# EAGLE schematic r (EAGLE 9.6.2)
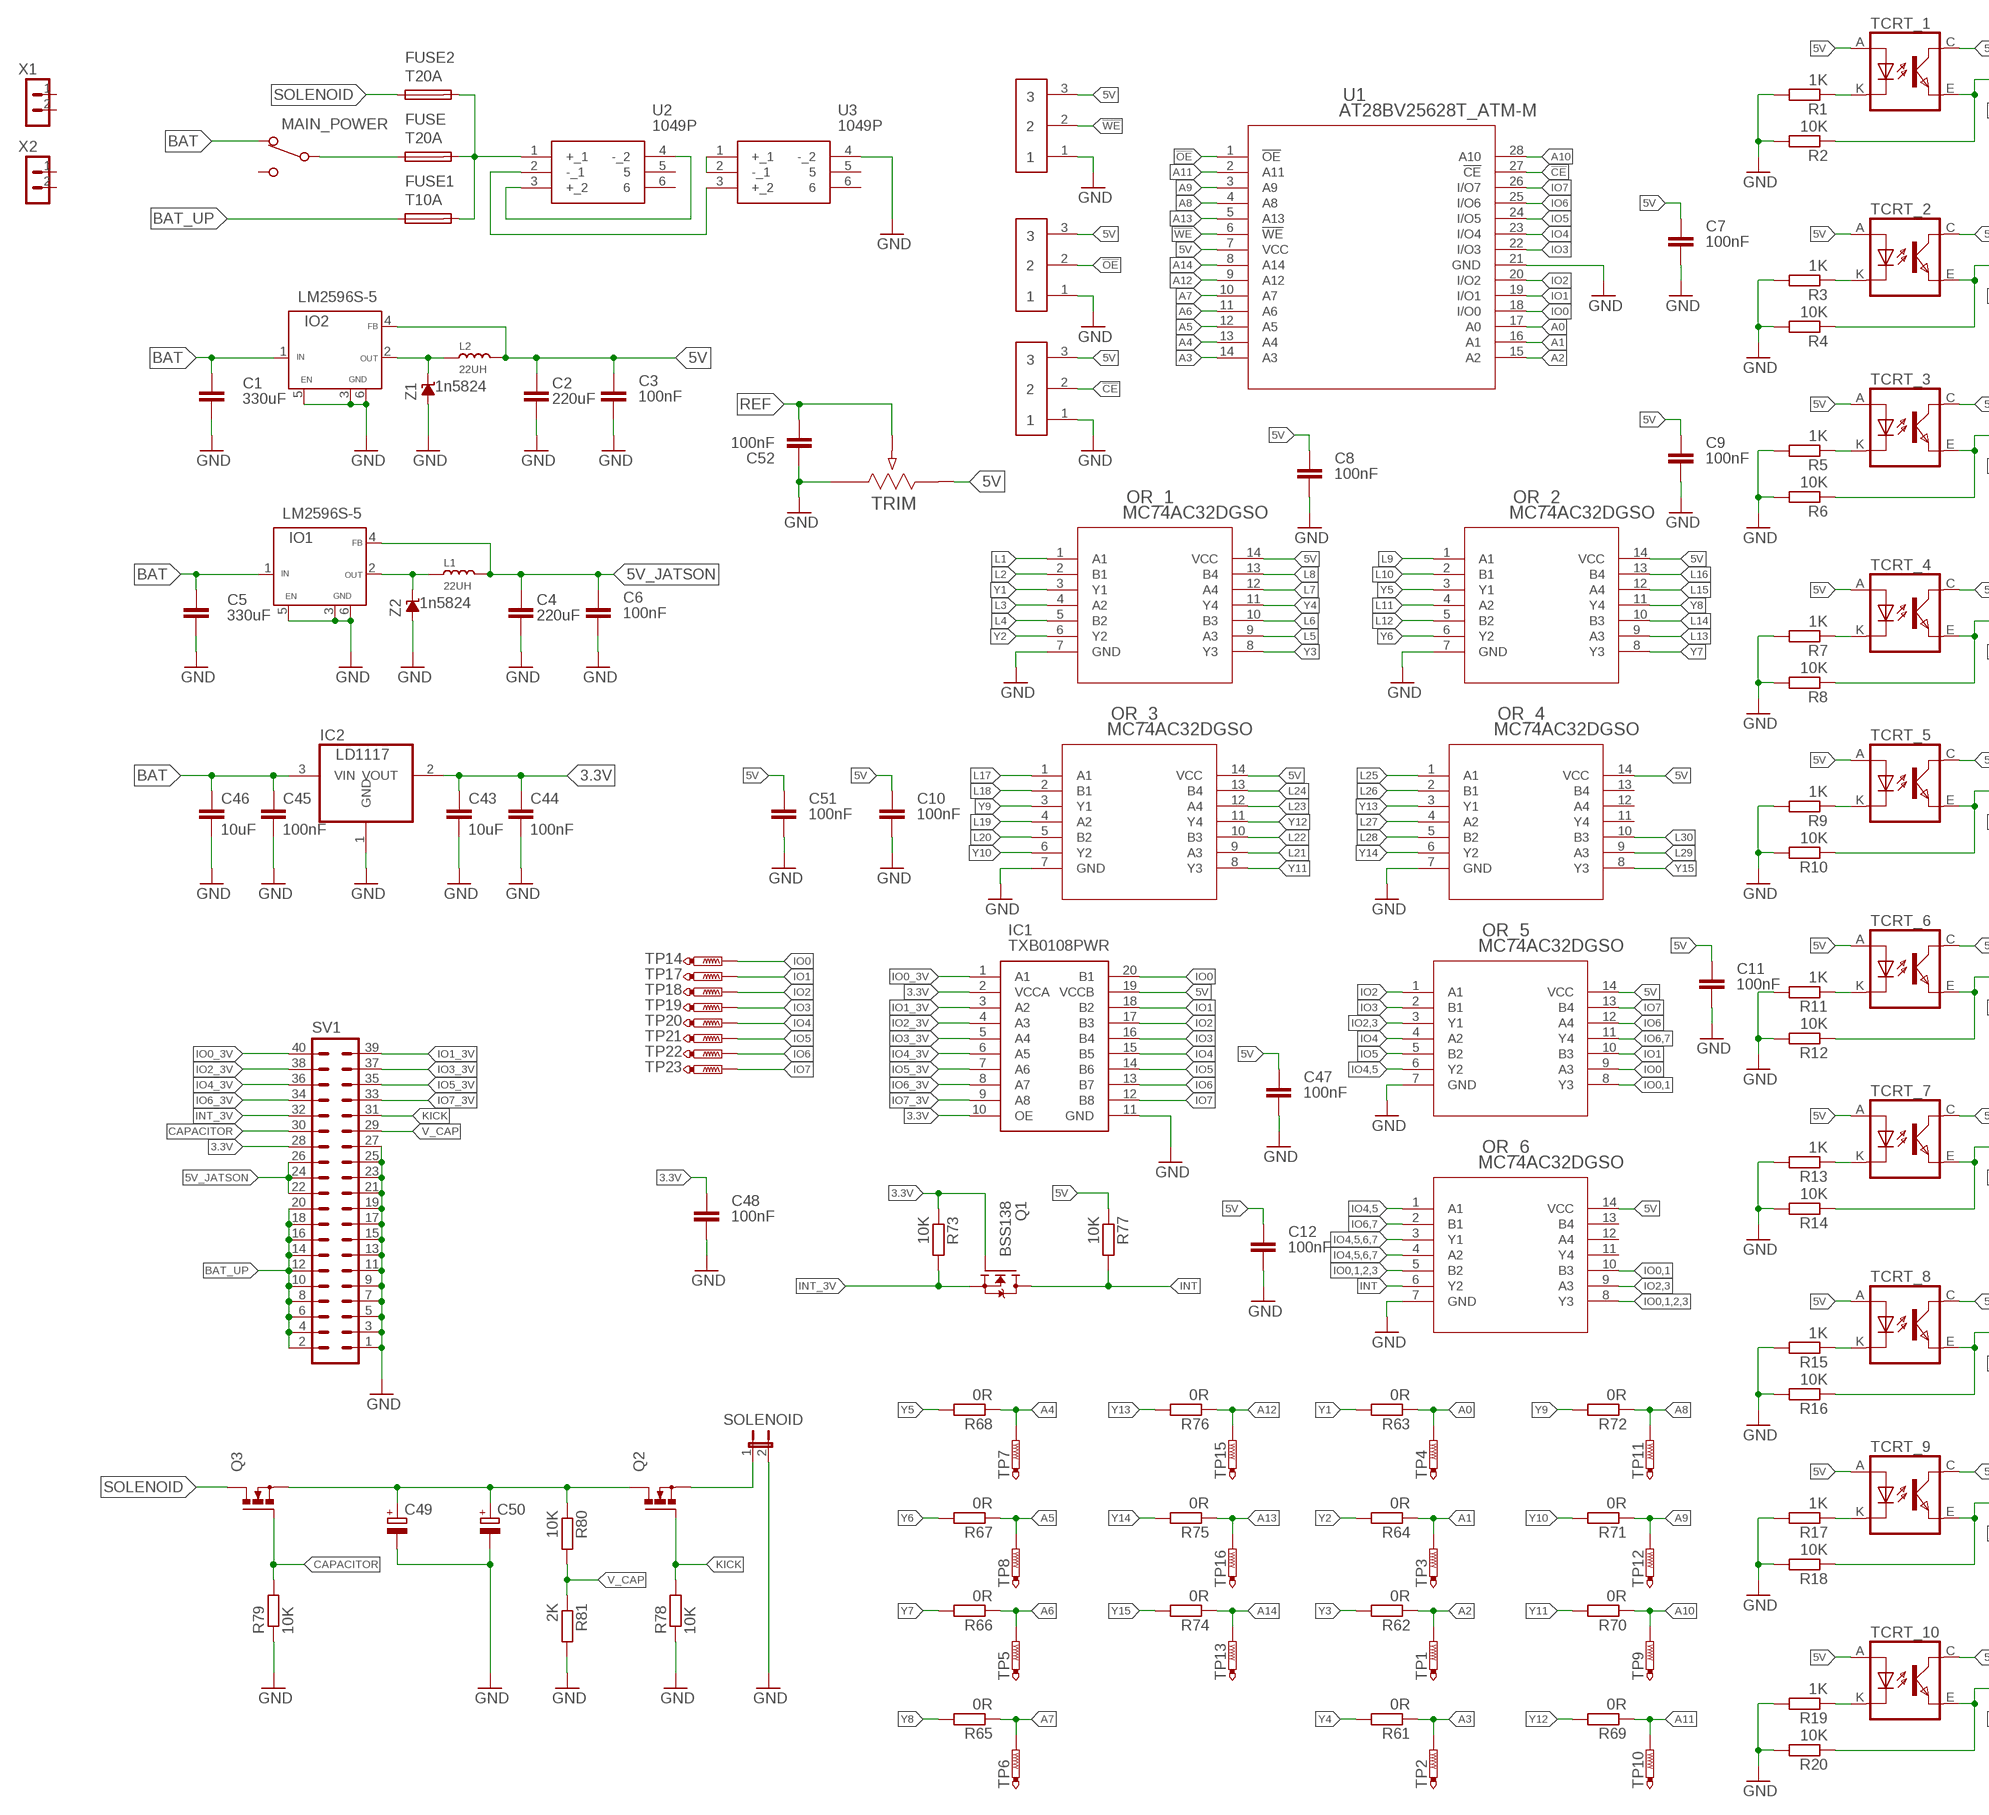
[diagram p0: schematic, sheet 1, part 1 of 2]
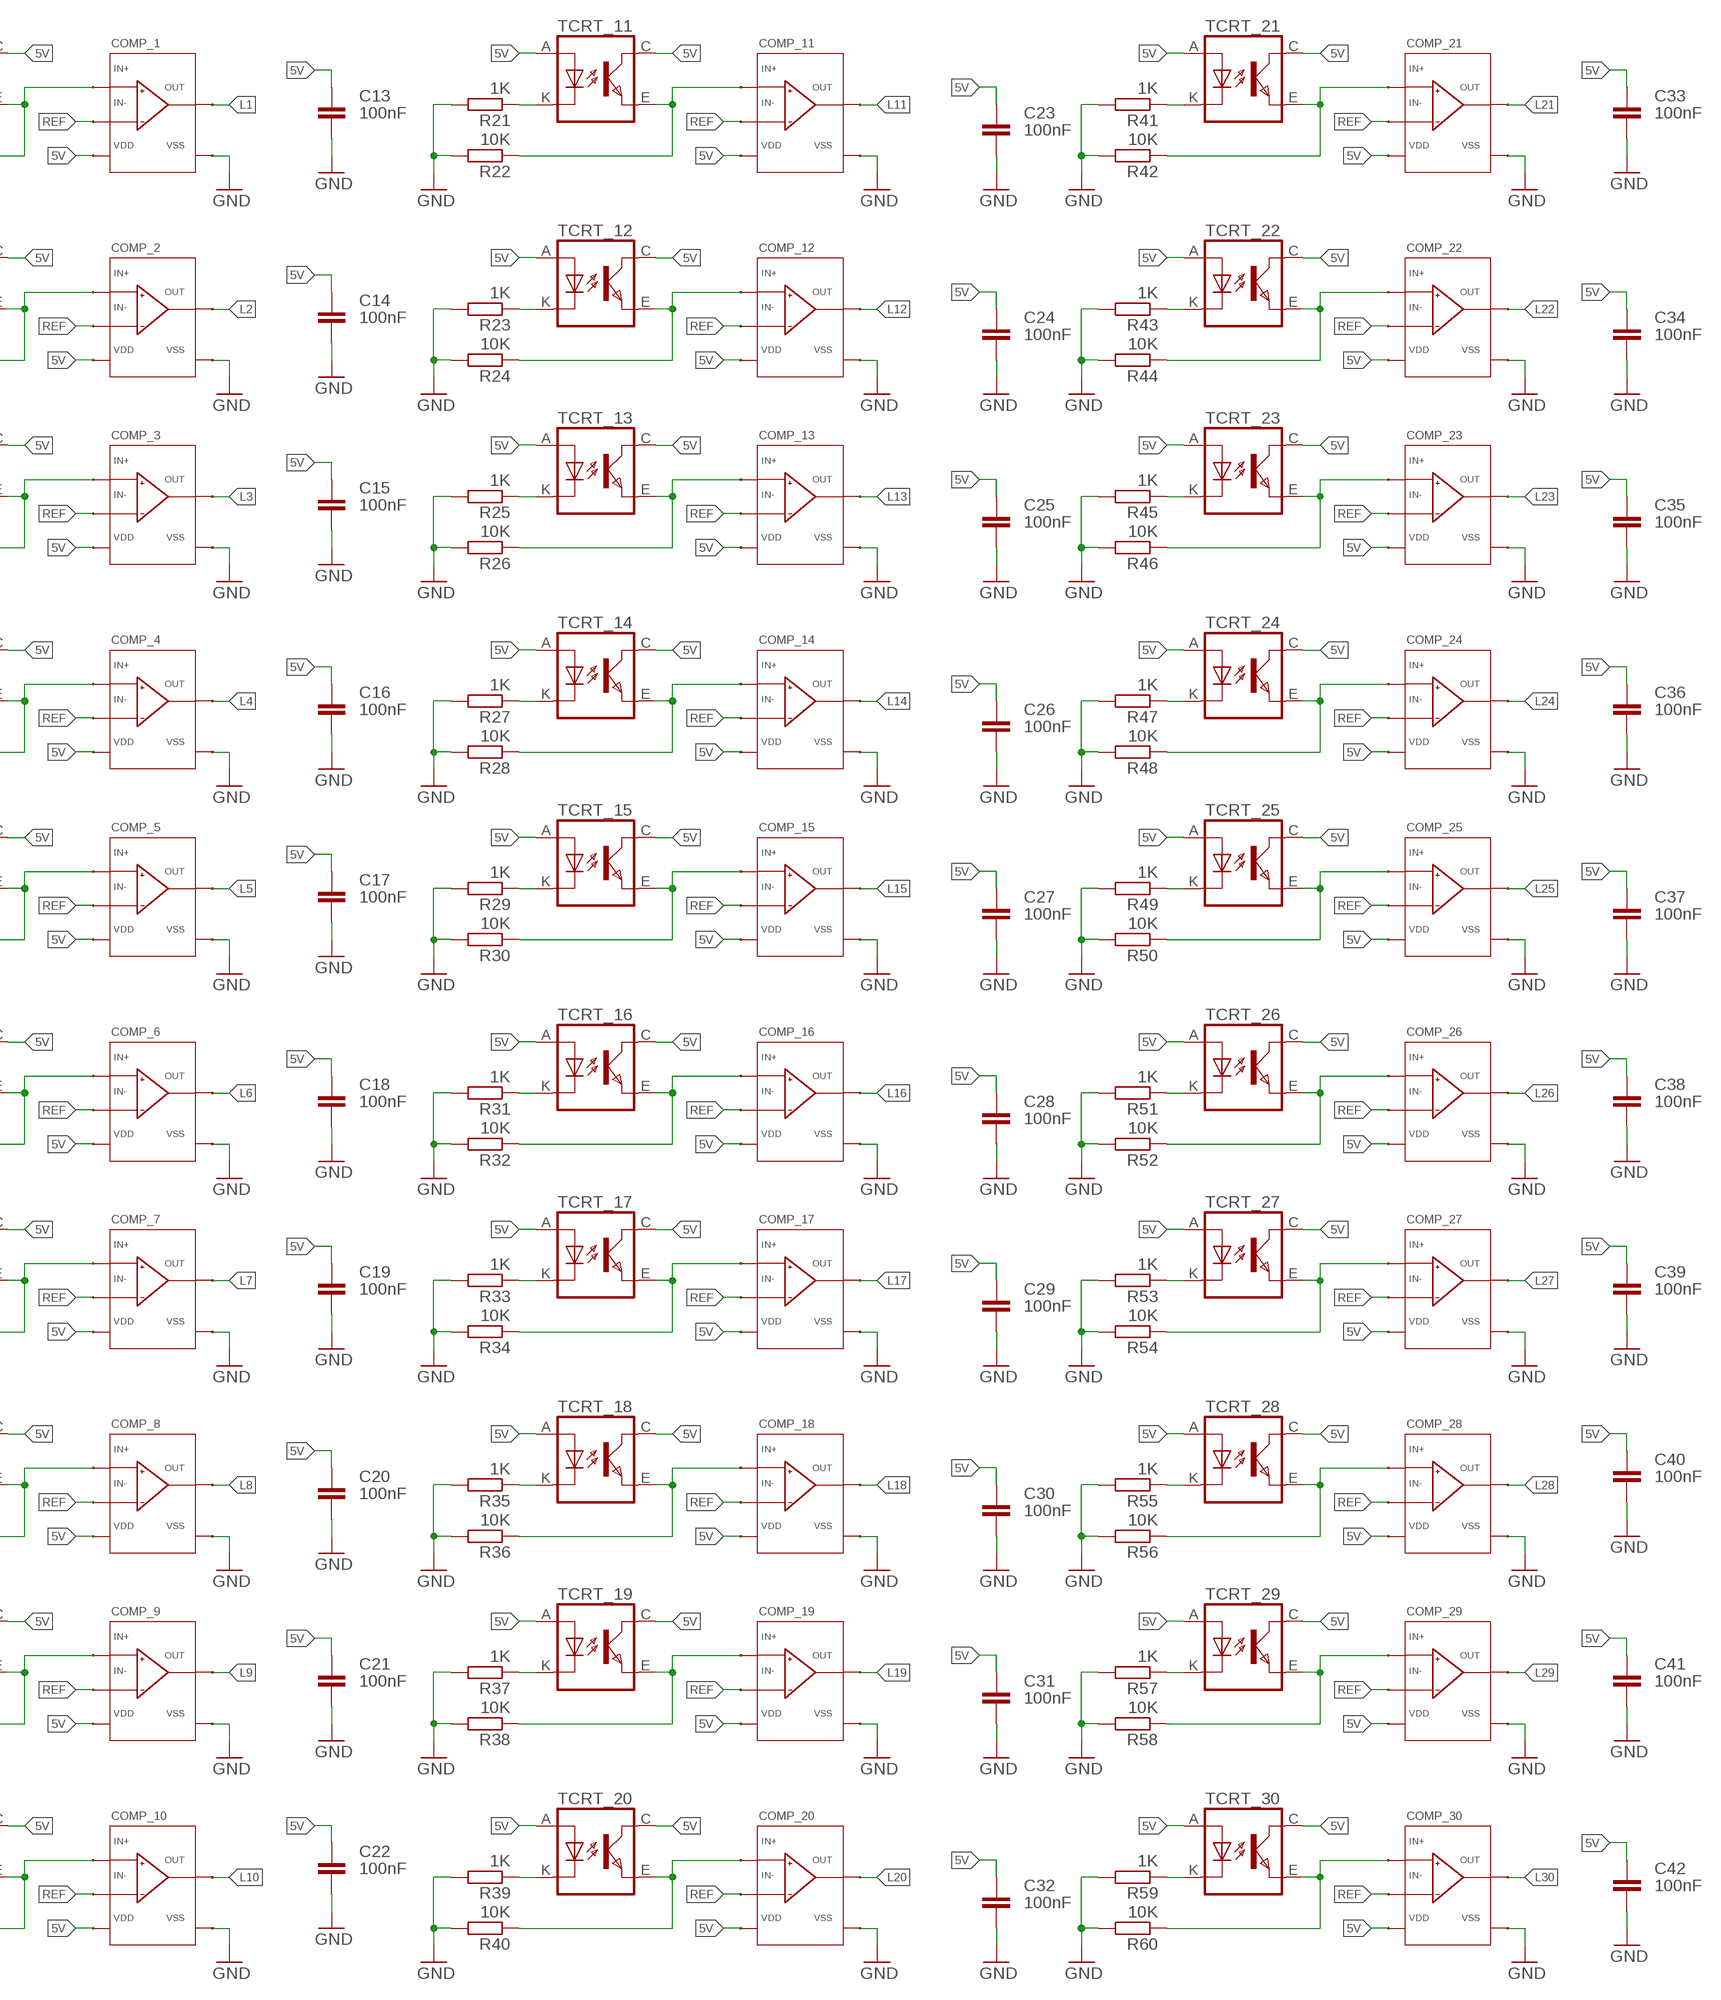
[diagram p1: schematic, sheet 1, part 2 of 2]

## Parts
C1  330uF  C_TANTALUM-2917(7343-METRIC)  [CAPM7343X310]
C2  220uF  C_TANTALUM-2917(7343-METRIC)  [CAPM7343X310]
C3  100nF  C-EUC0603  [C0603]
C4  220uF  C_TANTALUM-2917(7343-METRIC)  [CAPM7343X310]
C5  330uF  C_TANTALUM-2917(7343-METRIC)  [CAPM7343X310]
C6  100nF  C-EUC0603  [C0603]
C7  100nF  C-EUC0603  [C0603]
C8  100nF  C-EUC0603  [C0603]
C9  100nF  C-EUC0603  [C0603]
C10  100nF  C-EUC0603  [C0603]
C11  100nF  C-EUC0603  [C0603]
C12  100nF  C-EUC0603  [C0603]
C13  100nF  C-EUC0603  [C0603]
C14  100nF  C-EUC0603  [C0603]
C15  100nF  C-EUC0603  [C0603]
C16  100nF  C-EUC0603  [C0603]
C17  100nF  C-EUC0603  [C0603]
C18  100nF  C-EUC0603  [C0603]
C19  100nF  C-EUC0603  [C0603]
C20  100nF  C-EUC0603  [C0603]
C21  100nF  C-EUC0603  [C0603]
C22  100nF  C-EUC0603  [C0603]
C23  100nF  C-EUC0603  [C0603]
C24  100nF  C-EUC0603  [C0603]
C25  100nF  C-EUC0603  [C0603]
C26  100nF  C-EUC0603  [C0603]
C27  100nF  C-EUC0603  [C0603]
C28  100nF  C-EUC0603  [C0603]
C29  100nF  C-EUC0603  [C0603]
C30  100nF  C-EUC0603  [C0603]
C31  100nF  C-EUC0603  [C0603]
C32  100nF  C-EUC0603  [C0603]
C33  100nF  C-EUC0603  [C0603]
C34  100nF  C-EUC0603  [C0603]
C35  100nF  C-EUC0603  [C0603]
C36  100nF  C-EUC0603  [C0603]
C37  100nF  C-EUC0603  [C0603]
C38  100nF  C-EUC0603  [C0603]
C39  100nF  C-EUC0603  [C0603]
C40  100nF  C-EUC0603  [C0603]
C41  100nF  C-EUC0603  [C0603]
C42  100nF  C-EUC0603  [C0603]
C43  10uF  C-EUC0603  [C0603]
C44  100nF  C-EUC0603  [C0603]
C45  100nF  C-EUC0603  [C0603]
C46  10uF  C-EUC0603  [C0603]
C47  100nF  C-EUC0603  [C0603]
C48  100nF  C-EUC0603  [C0603]
C49  CPOL-EUE10-30  [EB30D]
C50  CPOL-EUE10-30  [EB30D]
C51  100nF  C-EUC0603  [C0603]
C52  100nF  C-EUC0603  [C0603]
COMP_1  TC75S56FUTE85LF  [SOT-353___(USV)_TOS]
COMP_2  TC75S56FUTE85LF  [SOT-353___(USV)_TOS]
COMP_3  TC75S56FUTE85LF  [SOT-353___(USV)_TOS]
COMP_4  TC75S56FUTE85LF  [SOT-353___(USV)_TOS]
COMP_5  TC75S56FUTE85LF  [SOT-353___(USV)_TOS]
COMP_6  TC75S56FUTE85LF  [SOT-353___(USV)_TOS]
COMP_7  TC75S56FUTE85LF  [SOT-353___(USV)_TOS]
COMP_8  TC75S56FUTE85LF  [SOT-353___(USV)_TOS]
COMP_9  TC75S56FUTE85LF  [SOT-353___(USV)_TOS]
COMP_10  TC75S56FUTE85LF  [SOT-353___(USV)_TOS]
COMP_11  TC75S56FUTE85LF  [SOT-353___(USV)_TOS]
COMP_12  TC75S56FUTE85LF  [SOT-353___(USV)_TOS]
COMP_13  TC75S56FUTE85LF  [SOT-353___(USV)_TOS]
COMP_14  TC75S56FUTE85LF  [SOT-353___(USV)_TOS]
COMP_15  TC75S56FUTE85LF  [SOT-353___(USV)_TOS]
COMP_16  TC75S56FUTE85LF  [SOT-353___(USV)_TOS]
COMP_17  TC75S56FUTE85LF  [SOT-353___(USV)_TOS]
COMP_18  TC75S56FUTE85LF  [SOT-353___(USV)_TOS]
COMP_19  TC75S56FUTE85LF  [SOT-353___(USV)_TOS]
COMP_20  TC75S56FUTE85LF  [SOT-353___(USV)_TOS]
COMP_21  TC75S56FUTE85LF  [SOT-353___(USV)_TOS]
COMP_22  TC75S56FUTE85LF  [SOT-353___(USV)_TOS]
COMP_23  TC75S56FUTE85LF  [SOT-353___(USV)_TOS]
COMP_24  TC75S56FUTE85LF  [SOT-353___(USV)_TOS]
COMP_25  TC75S56FUTE85LF  [SOT-353___(USV)_TOS]
COMP_26  TC75S56FUTE85LF  [SOT-353___(USV)_TOS]
COMP_27  TC75S56FUTE85LF  [SOT-353___(USV)_TOS]
COMP_28  TC75S56FUTE85LF  [SOT-353___(USV)_TOS]
COMP_29  TC75S56FUTE85LF  [SOT-353___(USV)_TOS]
COMP_30  TC75S56FUTE85LF  [SOT-353___(USV)_TOS]
FUSE  T20A  POISTKA2A  [SH22,5A]
FUSE1  T10A  POISTKA2A  [SH22,5A]
FUSE2  T20A  POISTKA2A  [SH22,5A]
IC1  TXB0108PWR  [SOP65P640X120-20N]
IC2  LD1117  [SOT223]
IO1  LM2596S-5  LM2596S  [TO263-5]
IO2  LM2596S-5  LM2596S  [TO263-5]
L1  22UH  INDUCTOR/FERRITE-BEAD0630  [INDUCTOR_L0630]
L2  22UH  INDUCTOR/FERRITE-BEAD0630  [INDUCTOR_L0630]
MAIN_POWER  PREP-1PB  [P-B069B]
OR_1  MC74AC32DGSO  MC74AC32DGSOIC-14_NB_ONS-M  [SOIC-14_NB_ONS-M]
OR_2  MC74AC32DGSO  MC74AC32DGSOIC-14_NB_ONS-M  [SOIC-14_NB_ONS-M]
OR_3  MC74AC32DGSO  MC74AC32DGSOIC-14_NB_ONS-M  [SOIC-14_NB_ONS-M]
OR_4  MC74AC32DGSO  MC74AC32DGSOIC-14_NB_ONS-M  [SOIC-14_NB_ONS-M]
OR_5  MC74AC32DGSO  MC74AC32DGSOIC-14_NB_ONS-M  [SOIC-14_NB_ONS-M]
OR_6  MC74AC32DGSO  MC74AC32DGSOIC-14_NB_ONS-M  [SOIC-14_NB_ONS-M]
Q1  BSS138  [SOT23]
Q2  PMOSFET_NTO220BV  [TO220BV]
Q3  PMOSFET_NTO220BV  [TO220BV]
R1  1K  R-EU_R0603  [R0603]
R2  10K  R-EU_R0603  [R0603]
R3  1K  R-EU_R0603  [R0603]
R4  10K  R-EU_R0603  [R0603]
R5  1K  R-EU_R0603  [R0603]
R6  10K  R-EU_R0603  [R0603]
R7  1K  R-EU_R0603  [R0603]
R8  10K  R-EU_R0603  [R0603]
R9  1K  R-EU_R0603  [R0603]
R10  10K  R-EU_R0603  [R0603]
R11  1K  R-EU_R0603  [R0603]
R12  10K  R-EU_R0603  [R0603]
R13  1K  R-EU_R0603  [R0603]
R14  10K  R-EU_R0603  [R0603]
R15  1K  R-EU_R0603  [R0603]
R16  10K  R-EU_R0603  [R0603]
R17  1K  R-EU_R0603  [R0603]
R18  10K  R-EU_R0603  [R0603]
R19  1K  R-EU_R0603  [R0603]
R20  10K  R-EU_R0603  [R0603]
R21  1K  R-EU_R0603  [R0603]
R22  10K  R-EU_R0603  [R0603]
R23  1K  R-EU_R0603  [R0603]
R24  10K  R-EU_R0603  [R0603]
R25  1K  R-EU_R0603  [R0603]
R26  10K  R-EU_R0603  [R0603]
R27  1K  R-EU_R0603  [R0603]
R28  10K  R-EU_R0603  [R0603]
R29  1K  R-EU_R0603  [R0603]
R30  10K  R-EU_R0603  [R0603]
R31  1K  R-EU_R0603  [R0603]
R32  10K  R-EU_R0603  [R0603]
R33  1K  R-EU_R0603  [R0603]
R34  10K  R-EU_R0603  [R0603]
R35  1K  R-EU_R0603  [R0603]
R36  10K  R-EU_R0603  [R0603]
R37  1K  R-EU_R0603  [R0603]
R38  10K  R-EU_R0603  [R0603]
R39  1K  R-EU_R0603  [R0603]
R40  10K  R-EU_R0603  [R0603]
R41  1K  R-EU_R0603  [R0603]
R42  10K  R-EU_R0603  [R0603]
R43  1K  R-EU_R0603  [R0603]
R44  10K  R-EU_R0603  [R0603]
R45  1K  R-EU_R0603  [R0603]
R46  10K  R-EU_R0603  [R0603]
R47  1K  R-EU_R0603  [R0603]
R48  10K  R-EU_R0603  [R0603]
R49  1K  R-EU_R0603  [R0603]
R50  10K  R-EU_R0603  [R0603]
R51  1K  R-EU_R0603  [R0603]
R52  10K  R-EU_R0603  [R0603]
R53  1K  R-EU_R0603  [R0603]
R54  10K  R-EU_R0603  [R0603]
R55  1K  R-EU_R0603  [R0603]
R56  10K  R-EU_R0603  [R0603]
R57  1K  R-EU_R0603  [R0603]
R58  10K  R-EU_R0603  [R0603]
R59  1K  R-EU_R0603  [R0603]
R60  10K  R-EU_R0603  [R0603]
R61  0R  R-EU_R0603  [R0603]
R62  0R  R-EU_R0603  [R0603]
R63  0R  R-EU_R0603  [R0603]
R64  0R  R-EU_R0603  [R0603]
R65  0R  R-EU_R0603  [R0603]
R66  0R  R-EU_R0603  [R0603]
R67  0R  R-EU_R0603  [R0603]
R68  0R  R-EU_R0603  [R0603]
R69  0R  R-EU_R0603  [R0603]
R70  0R  R-EU_R0603  [R0603]
R71  0R  R-EU_R0603  [R0603]
R72  0R  R-EU_R0603  [R0603]
R73  10K  R-EU_R0603  [R0603]
R74  0R  R-EU_R0603  [R0603]
R75  0R  R-EU_R0603  [R0603]
R76  0R  R-EU_R0603  [R0603]
R77  10K  R-EU_R0603  [R0603]
R78  10K  R-EU_R1206  [R1206]
R79  10K  R-EU_R1206  [R1206]
R80  10K  R-EU_R0603  [R0603]
R81  2K  R-EU_R0603  [R0603]
SOLENOID  JP1E  [JP1]
SV1  MLW40  [ML40]
TCRT_1  TCRT5000  [TCRT5000]
TCRT_2  TCRT5000  [TCRT5000]
TCRT_3  TCRT5000  [TCRT5000]
TCRT_4  TCRT5000  [TCRT5000]
TCRT_5  TCRT5000  [TCRT5000]
TCRT_6  TCRT5000  [TCRT5000]
TCRT_7  TCRT5000  [TCRT5000]
TCRT_8  TCRT5000  [TCRT5000]
TCRT_9  TCRT5000  [TCRT5000]
TCRT_10  TCRT5000  [TCRT5000]
TCRT_11  TCRT5000  [TCRT5000]
TCRT_12  TCRT5000  [TCRT5000]
TCRT_13  TCRT5000  [TCRT5000]
TCRT_14  TCRT5000  [TCRT5000]
TCRT_15  TCRT5000  [TCRT5000]
TCRT_16  TCRT5000  [TCRT5000]
TCRT_17  TCRT5000  [TCRT5000]
TCRT_18  TCRT5000  [TCRT5000]
TCRT_19  TCRT5000  [TCRT5000]
TCRT_20  TCRT5000  [TCRT5000]
TCRT_21  TCRT5000  [TCRT5000]
TCRT_22  TCRT5000  [TCRT5000]
TCRT_23  TCRT5000  [TCRT5000]
TCRT_24  TCRT5000  [TCRT5000]
TCRT_25  TCRT5000  [TCRT5000]
TCRT_26  TCRT5000  [TCRT5000]
TCRT_27  TCRT5000  [TCRT5000]
TCRT_28  TCRT5000  [TCRT5000]
TCRT_29  TCRT5000  [TCRT5000]
TCRT_30  TCRT5000  [TCRT5000]
TP1  PTR1TP20R  [TP20R]
TP2  PTR1TP20R  [TP20R]
TP3  PTR1TP20R  [TP20R]
TP4  PTR1TP20R  [TP20R]
TP5  PTR1TP20R  [TP20R]
TP6  PTR1TP20R  [TP20R]
TP7  PTR1TP20R  [TP20R]
TP8  PTR1TP20R  [TP20R]
TP9  PTR1TP20R  [TP20R]
TP10  PTR1TP20R  [TP20R]
TP11  PTR1TP20R  [TP20R]
TP12  PTR1TP20R  [TP20R]
TP13  PTR1TP20R  [TP20R]
TP14  PTR1TP20R  [TP20R]
TP15  PTR1TP20R  [TP20R]
TP16  PTR1TP20R  [TP20R]
TP17  PTR1TP20R  [TP20R]
TP18  PTR1TP20R  [TP20R]
TP19  PTR1TP20R  [TP20R]
TP20  PTR1TP20R  [TP20R]
TP21  PTR1TP20R  [TP20R]
TP22  PTR1TP20R  [TP20R]
TP23  PTR1TP20R  [TP20R]
TRIM  3362W-1-103LF  [POT_3362W]
U1  AT28BV25628T_ATM-M  [28T_ATM-M]
U2  1049P  [1049P]
U3  1049P  [1049P]
U$1  0603_S  [0603_S]
U$2  0603_S  [0603_S]
U$3  0603_S  [0603_S]
X1  ML2"  [ML2]
X2  ML2"  [ML2]
Z1  1n5824  SUPRESSOR_TVS-UD-SMAJ  [SUPRESSOR_SMAJ]
Z2  1n5824  SUPRESSOR_TVS-UD-SMAJ  [SUPRESSOR_SMAJ]

## Nets
3.3V: C43.1 C44.1 C48.1 IC1.2(VCCA) IC1.10(OE) IC2.2(VOUT) Q1.1(G) R73.1 SV1.28
5V: C2.1 C3.1 C7.1 C8.1 C9.1 C10.1 C11.1 C12.1 C13.1 C14.1 C15.1 C16.1 C17.1 C18.1 C19.1 C20.1 C21.1 C22.1 C23.1 C24.1 C25.1 C26.1 C27.1 C28.1 C29.1 C30.1 C31.1 C32.1 C33.1 C34.1 C35.1 C36.1 C37.1 C38.1 C39.1 C40.1 C41.1 C42.1 C47.1 C51.1 COMP_1.5 COMP_2.5 COMP_3.5 COMP_4.5 COMP_5.5 COMP_6.5 COMP_7.5 COMP_8.5 COMP_9.5 COMP_10.5 COMP_11.5 COMP_12.5 COMP_13.5 COMP_14.5 COMP_15.5 COMP_16.5 COMP_17.5 COMP_18.5 COMP_19.5 COMP_20.5 COMP_21.5 COMP_22.5 COMP_23.5 COMP_24.5 COMP_25.5 COMP_26.5 COMP_27.5 COMP_28.5 COMP_29.5 COMP_30.5 IC1.19(VCCB) IO2.4(FB) L2.2 OR_1.14(VCC) OR_2.14(VCC) OR_3.14(VCC) OR_4.14(VCC) OR_5.14(VCC) OR_6.14(VCC) R77.1 TCRT_1.A(ANODE) TCRT_1.C(COLLECTOR) TCRT_2.A(ANODE) TCRT_2.C(COLLECTOR) TCRT_3.A(ANODE) TCRT_3.C(COLLECTOR) TCRT_4.A(ANODE) TCRT_4.C(COLLECTOR) TCRT_5.A(ANODE) TCRT_5.C(COLLECTOR) TCRT_6.A(ANODE) TCRT_6.C(COLLECTOR) TCRT_7.A(ANODE) TCRT_7.C(COLLECTOR) TCRT_8.A(ANODE) TCRT_8.C(COLLECTOR) TCRT_9.A(ANODE) TCRT_9.C(COLLECTOR) TCRT_10.A(ANODE) TCRT_10.C(COLLECTOR) TCRT_11.A(ANODE) TCRT_11.C(COLLECTOR) TCRT_12.A(ANODE) TCRT_12.C(COLLECTOR) TCRT_13.A(ANODE) TCRT_13.C(COLLECTOR) TCRT_14.A(ANODE) TCRT_14.C(COLLECTOR) TCRT_15.A(ANODE) TCRT_15.C(COLLECTOR) TCRT_16.A(ANODE) TCRT_16.C(COLLECTOR) TCRT_17.A(ANODE) TCRT_17.C(COLLECTOR) TCRT_18.A(ANODE) TCRT_18.C(COLLECTOR) TCRT_19.A(ANODE) TCRT_19.C(COLLECTOR) TCRT_20.A(ANODE) TCRT_20.C(COLLECTOR) TCRT_21.A(ANODE) TCRT_21.C(COLLECTOR) TCRT_22.A(ANODE) TCRT_22.C(COLLECTOR) TCRT_23.A(ANODE) TCRT_23.C(COLLECTOR) TCRT_24.A(ANODE) TCRT_24.C(COLLECTOR) TCRT_25.A(ANODE) TCRT_25.C(COLLECTOR) TCRT_26.A(ANODE) TCRT_26.C(COLLECTOR) TCRT_27.A(ANODE) TCRT_27.C(COLLECTOR) TCRT_28.A(ANODE) TCRT_28.C(COLLECTOR) TCRT_29.A(ANODE) TCRT_29.C(COLLECTOR) TCRT_30.A(ANODE) TCRT_30.C(COLLECTOR) TRIM.3 U1.7(VCC) U$1.3(A3) U$2.3(A3) U$3.3(A3)
5V_JATSON: C4.1 C6.1 IO1.4(FB) L1.2 SV1.22 SV1.24 SV1.26
!CE: U1.27(!CE) U$3.2(A2)
!OE: U1.1(!OE) U$2.2(A2)
!WE: U1.6(!WE) U$1.2(A2)
A0: R63.1 TP4.TP U1.17(A0)
A1: R64.1 TP3.TP U1.16(A1)
A2: R62.1 TP1.TP U1.15(A2)
A3: R61.1 TP2.TP U1.14(A3)
A4: R68.1 TP7.TP U1.13(A4)
A5: R67.1 TP8.TP U1.12(A5)
A6: R66.1 TP5.TP U1.11(A6)
A7: R65.1 TP6.TP U1.10(A7)
A8: R72.1 TP11.TP U1.4(A8)
A9: R71.1 TP12.TP U1.3(A9)
A10: R70.1 TP9.TP U1.28(A10)
A11: R69.1 TP10.TP U1.2(A11)
A12: R76.1 TP15.TP U1.9(A12)
A13: R75.1 TP16.TP U1.5(A13)
A14: R74.1 TP13.TP U1.8(A14)
BAT: C1.1 C5.1 C45.1 C46.1 IC2.3(VIN) IO1.1(IN) IO2.1(IN) MAIN_POWER.3(3-ON)
BAT_UP: FUSE1.1 SV1.2 SV1.4 SV1.6 SV1.8 SV1.10 SV1.12 SV1.14 SV1.16 SV1.18 SV1.20
CAPACITOR: Q3.G R79.2 SV1.30
GND: C1.2 C2.2 C3.2 C4.2 C5.2 C6.2 C7.2 C8.2 C9.2 C10.2 C11.2 C12.2 C13.2 C14.2 C15.2 C16.2 C17.2 C18.2 C19.2 C20.2 C21.2 C22.2 C23.2 C24.2 C25.2 C26.2 C27.2 C28.2 C29.2 C30.2 C31.2 C32.2 C33.2 C34.2 C35.2 C36.2 C37.2 C38.2 C39.2 C40.2 C41.2 C42.2 C43.2 C44.2 C45.2 C46.2 C47.2 C48.2 C49.- C50.- C51.2 C52.1 COMP_1.2 COMP_2.2 COMP_3.2 COMP_4.2 COMP_5.2 COMP_6.2 COMP_7.2 COMP_8.2 COMP_9.2 COMP_10.2 COMP_11.2 COMP_12.2 COMP_13.2 COMP_14.2 COMP_15.2 COMP_16.2 COMP_17.2 COMP_18.2 COMP_19.2 COMP_20.2 COMP_21.2 COMP_22.2 COMP_23.2 COMP_24.2 COMP_25.2 COMP_26.2 COMP_27.2 COMP_28.2 COMP_29.2 COMP_30.2 IC1.11(GND) IC2.1(GND) IO1.3(GND) IO1.5(EN) IO1.6(GND) IO2.3(GND) IO2.5(EN) IO2.6(GND) OR_1.7(GND) OR_2.7(GND) OR_3.7(GND) OR_4.7(GND) OR_5.7(GND) OR_6.7(GND) R1.2 R2.2 R3.2 R4.2 R5.2 R6.2 R7.2 R8.2 R9.2 R10.2 R11.2 R12.2 R13.2 R14.2 R15.2 R16.2 R17.2 R18.2 R19.2 R20.2 R21.2 R22.2 R23.2 R24.2 R25.2 R26.2 R27.2 R28.2 R29.2 R30.2 R31.2 R32.2 R33.2 R34.2 R35.2 R36.2 R37.2 R38.2 R39.2 R40.2 R41.2 R42.2 R43.2 R44.2 R45.2 R46.2 R47.2 R48.2 R49.2 R50.2 R51.2 R52.2 R53.2 R54.2 R55.2 R56.2 R57.2 R58.2 R59.2 R60.2 R78.1 R79.1 R81.2 SOLENOID.2 SV1.1 SV1.3 SV1.5 SV1.7 SV1.9 SV1.11 SV1.13 SV1.15 SV1.17 SV1.19 SV1.21 SV1.23 SV1.25 SV1.27 TRIM.1 U1.21(GND) U3.4(-_2) U$1.1(A1) U$2.1(A1) U$3.1(A1) Z1.A Z2.A
INT: OR_6.6(Y2) Q1.3(D) R77.2
INT_3V: Q1.2(S) R73.2 SV1.32
IO0: IC1.20(B1) OR_5.9(A3) TP14.TP U1.18(I/O0)
IO0,1: OR_5.8(Y3) OR_6.10(B3)
IO0,1,2,3: OR_6.5(B2) OR_6.8(Y3)
IO0_3V: IC1.1(A1) SV1.40
IO1: IC1.18(B2) OR_5.10(B3) TP17.TP U1.19(I/O1)
IO1_3V: IC1.3(A2) SV1.39
IO2: IC1.17(B3) OR_5.1(A1) TP18.TP U1.20(I/O2)
IO2,3: OR_5.3(Y1) OR_6.9(A3)
IO2_3V: IC1.4(A3) SV1.38
IO3: IC1.16(B4) OR_5.2(B1) TP19.TP U1.22(I/O3)
IO3_3V: IC1.5(A4) SV1.37
IO4: IC1.15(B5) OR_5.4(A2) TP20.TP U1.23(I/O4)
IO4,5: OR_5.6(Y2) OR_6.1(A1)
IO4,5,6,7: OR_6.3(Y1) OR_6.4(A2)
IO4_3V: IC1.6(A5) SV1.36
IO5: IC1.14(B6) OR_5.5(B2) TP21.TP U1.24(I/O5)
IO5_3V: IC1.7(A6) SV1.35
IO6: IC1.13(B7) OR_5.12(A4) TP22.TP U1.25(I/O6)
IO6,7: OR_5.11(Y4) OR_6.2(B1)
IO6_3V: IC1.8(A7) SV1.34
IO7: IC1.12(B8) OR_5.13(B4) TP23.TP U1.26(I/O7)
IO7_3V: IC1.9(A8) SV1.33
KICK: Q2.G R78.2 SV1.31
L1: COMP_1.4 OR_1.1(A1)
L2: COMP_2.4 OR_1.2(B1)
L3: COMP_3.4 OR_1.4(A2)
L4: COMP_4.4 OR_1.5(B2)
L5: COMP_5.4 OR_1.9(A3)
L6: COMP_6.4 OR_1.10(B3)
L7: COMP_7.4 OR_1.12(A4)
L8: COMP_8.4 OR_1.13(B4)
L9: COMP_9.4 OR_2.1(A1)
L10: COMP_10.4 OR_2.2(B1)
L11: COMP_11.4 OR_2.4(A2)
L12: COMP_12.4 OR_2.5(B2)
L13: COMP_13.4 OR_2.9(A3)
L14: COMP_14.4 OR_2.10(B3)
L15: COMP_15.4 OR_2.12(A4)
L16: COMP_16.4 OR_2.13(B4)
L17: COMP_17.4 OR_3.1(A1)
L18: COMP_18.4 OR_3.2(B1)
L19: COMP_19.4 OR_3.4(A2)
L20: COMP_20.4 OR_3.5(B2)
L21: COMP_21.4 OR_3.9(A3)
L22: COMP_22.4 OR_3.10(B3)
L23: COMP_23.4 OR_3.12(A4)
L24: COMP_24.4 OR_3.13(B4)
L25: COMP_25.4 OR_4.1(A1)
L26: COMP_26.4 OR_4.2(B1)
L27: COMP_27.4 OR_4.4(A2)
L28: COMP_28.4 OR_4.5(B2)
L29: COMP_29.4 OR_4.9(A3)
L30: COMP_30.4 OR_4.10(B3)
N$1: R1.1 TCRT_1.K(CATHODE)
N$2: COMP_1.3 R2.1 TCRT_1.E(EMITTER)
N$3: R3.1 TCRT_2.K(CATHODE)
N$4: COMP_2.3 R4.1 TCRT_2.E(EMITTER)
N$5: R5.1 TCRT_3.K(CATHODE)
N$6: COMP_3.3 R6.1 TCRT_3.E(EMITTER)
N$7: R7.1 TCRT_4.K(CATHODE)
N$8: COMP_4.3 R8.1 TCRT_4.E(EMITTER)
N$9: R9.1 TCRT_5.K(CATHODE)
N$10: COMP_5.3 R10.1 TCRT_5.E(EMITTER)
N$11: R11.1 TCRT_6.K(CATHODE)
N$12: COMP_6.3 R12.1 TCRT_6.E(EMITTER)
N$13: R13.1 TCRT_7.K(CATHODE)
N$14: COMP_7.3 R14.1 TCRT_7.E(EMITTER)
N$15: R15.1 TCRT_8.K(CATHODE)
N$16: COMP_8.3 R16.1 TCRT_8.E(EMITTER)
N$17: R17.1 TCRT_9.K(CATHODE)
N$18: COMP_9.3 R18.1 TCRT_9.E(EMITTER)
N$19: R19.1 TCRT_10.K(CATHODE)
N$20: COMP_10.3 R20.1 TCRT_10.E(EMITTER)
N$21: R21.1 TCRT_11.K(CATHODE)
N$22: COMP_11.3 R22.1 TCRT_11.E(EMITTER)
N$23: R23.1 TCRT_12.K(CATHODE)
N$24: COMP_12.3 R24.1 TCRT_12.E(EMITTER)
N$25: R25.1 TCRT_13.K(CATHODE)
N$26: COMP_13.3 R26.1 TCRT_13.E(EMITTER)
N$27: R27.1 TCRT_14.K(CATHODE)
N$28: COMP_14.3 R28.1 TCRT_14.E(EMITTER)
N$29: R29.1 TCRT_15.K(CATHODE)
N$30: COMP_15.3 R30.1 TCRT_15.E(EMITTER)
N$31: R31.1 TCRT_16.K(CATHODE)
N$32: COMP_16.3 R32.1 TCRT_16.E(EMITTER)
N$33: R33.1 TCRT_17.K(CATHODE)
N$34: COMP_17.3 R34.1 TCRT_17.E(EMITTER)
N$35: R35.1 TCRT_18.K(CATHODE)
N$36: COMP_18.3 R36.1 TCRT_18.E(EMITTER)
N$37: R37.1 TCRT_19.K(CATHODE)
N$38: COMP_19.3 R38.1 TCRT_19.E(EMITTER)
N$39: R39.1 TCRT_20.K(CATHODE)
N$40: COMP_20.3 R40.1 TCRT_20.E(EMITTER)
N$41: R41.1 TCRT_21.K(CATHODE)
N$42: COMP_21.3 R42.1 TCRT_21.E(EMITTER)
N$43: R43.1 TCRT_22.K(CATHODE)
N$44: COMP_22.3 R44.1 TCRT_22.E(EMITTER)
N$45: R45.1 TCRT_23.K(CATHODE)
N$46: COMP_23.3 R46.1 TCRT_23.E(EMITTER)
N$47: R47.1 TCRT_24.K(CATHODE)
N$48: COMP_24.3 R48.1 TCRT_24.E(EMITTER)
N$49: R49.1 TCRT_25.K(CATHODE)
N$50: COMP_25.3 R50.1 TCRT_25.E(EMITTER)
N$51: R51.1 TCRT_26.K(CATHODE)
N$52: COMP_26.3 R52.1 TCRT_26.E(EMITTER)
N$53: R53.1 TCRT_27.K(CATHODE)
N$54: COMP_27.3 R54.1 TCRT_27.E(EMITTER)
N$55: R55.1 TCRT_28.K(CATHODE)
N$56: COMP_28.3 R56.1 TCRT_28.E(EMITTER)
N$57: R57.1 TCRT_29.K(CATHODE)
N$58: COMP_29.3 R58.1 TCRT_29.E(EMITTER)
N$59: R59.1 TCRT_30.K(CATHODE)
N$60: COMP_30.3 R60.1 TCRT_30.E(EMITTER)
N$61: IO2.2(OUT) L2.1 Z1.C
N$62: IO1.2(OUT) L1.1 Z2.C
N$63: U2.3(+_2) U2.4(-_2)
N$64: U3.1(+_1) U3.2(-_1)
N$65: U2.2(-_1) U3.3(+_2)
N$66: FUSE1.2 FUSE2.2 FUSE.2 U2.1(+_1)
N$67: FUSE.1 MAIN_POWER.2(2-COM)
N$69: C49.+ C50.+ Q2.D Q3.S R80.1
N$70: Q2.S SOLENOID.1
REF: C52.2 COMP_1.1 COMP_2.1 COMP_3.1 COMP_4.1 COMP_5.1 COMP_6.1 COMP_7.1 COMP_8.1 COMP_9.1 COMP_10.1 COMP_11.1 COMP_12.1 COMP_13.1 COMP_14.1 COMP_15.1 COMP_16.1 COMP_17.1 COMP_18.1 COMP_19.1 COMP_20.1 COMP_21.1 COMP_22.1 COMP_23.1 COMP_24.1 COMP_25.1 COMP_26.1 COMP_27.1 COMP_28.1 COMP_29.1 COMP_30.1 TRIM.2
SOLENOID: FUSE2.1 Q3.D
V_CAP: R80.2 R81.1 SV1.29
Y1: OR_1.3(Y1) R63.2
Y2: OR_1.6(Y2) R64.2
Y3: OR_1.8(Y3) R62.2
Y4: OR_1.11(Y4) R61.2
Y5: OR_2.3(Y1) R68.2
Y6: OR_2.6(Y2) R67.2
Y7: OR_2.8(Y3) R66.2
Y8: OR_2.11(Y4) R65.2
Y9: OR_3.3(Y1) R72.2
Y10: OR_3.6(Y2) R71.2
Y11: OR_3.8(Y3) R70.2
Y12: OR_3.11(Y4) R69.2
Y13: OR_4.3(Y1) R76.2
Y14: OR_4.6(Y2) R75.2
Y15: OR_4.8(Y3) R74.2
Unconnected: MAIN_POWER.1(1-OFF) OR_4.11(Y4) OR_4.12(A4) OR_4.13(B4) OR_6.11(Y4) OR_6.12(A4) OR_6.13(B4) U2.5 U2.6 U3.5 U3.6 X1.1 X1.2 X2.1 X2.2

## Library data of the parts
C1 C2 C4 C5 = Capacitor:C: Capacitor - Generic; CATEGORY: Capacitor
C3 C6-C48 C51 C52 = rcl:C-EU: CAPACITOR, European symbol; SPICEPREFIX: C
C49 C50 = rcl:CPOL-EU: POLARIZED CAPACITOR, European symbol; SPICEPREFIX: C
COMP_1-COMP_30 = comparator:TC75S56FUTE85LF
FUSE FUSE1 FUSE2 = TABOR K1:POISTKA2: Drziak sklopistky SH22,5A / vzdialenost vyvodov 22,5 mm /
IC1 = TXB0108PWR:TXB0108PWR: 8-Bit Bidirectional Voltage-Level Shifter with Auto Direction Sensing and +/-15-kV ESD Protect Source: Datasheet <http://www.ti.com/lit/ds/symlink/txb0108.pdf>; DESCRIPTION: 8-Bit Bidirectional Voltage-Level Shifter with Auto Direction Sensing and +/-15-kV ESD Protect; HEIGHT: 1.2mm; MANUFACTURER_NAME: Texas Instruments; MANUFACTURER_PART_NUMBER: TXB0108PWR; MOUSER_PART_NUMBER: 595-TXB0108PWR; MOUSER_PRICE-STOCK: https://www.mouser.co.uk/ProductDetail/Texas-Instruments/TXB0108PWR?qs=oFXvjAmG9EgEUWGWzOVFCA%3D%3D
IC2 = PulseOximeterECG_AU:LD1117: 800mA and 1A Low Dropout (LDO) Positive Regulator 1.8V, 2.5V, 2.85V, 3.3V, 5V, and Adj; MF: TEXAS INSTRUMENTS; MPN: REG1117FAKTTT; OC_FARNELL: 1296120; OC_NEWARK: 87H2562
IO1 IO2 = TABOR K1:LM2596: DC/DC pulzny regulator STEP-DOWN / 3A upraveny podla katalogu
L1 L2 = BeagleBone_Blue_R3:INDUCTOR/FERRITE-BEAD
MAIN_POWER = TABOR K1:PREP-1P: 1-polovy prepinac
OR_1-OR_6 = 74VHC32D:MC74AC32DG; COPYRIGHT: Copyright (C) 2016 Accelerated Designs. All rights reserved; MANUFACTURER_PART_NUMBER: MC74VHC32DR2G; SOURCELIBRARY: ONSemi_2017-12-12_1; VENDOR: ON Semiconductor
Q1 = bss138_10:BSS138: BSS138 N-Channel Logic Level Enhancement Mode Field Effect Transistor Source: http://www.fairchildsemi.com/datasheets/BS/BSS138.pdf; MF: Fairchild; MPN: BSS138; OC_FARNELL: 9845330; OC_NEWARK: 67R2009
Q2 Q3 = transistor-power:PMOSFET_N: Power MOSFET N-Channel
R1-R81 = rcl:R-EU_: RESISTOR, European symbol; SPICEPREFIX: R
SOLENOID = jumper:JP1E: JUMPER
SV1 = hacesoft:MLW40: HARTING
TCRT_1-TCRT_30 = tcrt5000:TCRT5000
TP1-TP23 = testpad:PTR1: TEST PIN
TRIM = 3362:3362W-1-103LF; BUILT_BY: EMA_UL_Team; MANUFACTURER_PART_NUMBER: 3362W-1-103LF; SOURCELIBRARY: Bourns_2012-08-08; VENDOR: Bourns Electronics
U1 = eeprom:AT28BV256; BUILT_BY: EMA_UL_Team; MANUFACTURER_PART_NUMBER: AT28BV256-20TU; SOURCELIBRARY: Atmel_2015-02-13; VENDOR: Atmel
U2 U3 = SamacSys_Parts:1049P: Cylindrical Battery Contacts, Clips, Holders & Springs THM Polarized Holder Dual 18650 Batteries Source: Datasheet <https://www.keyelco.com/product-pdf.cfm?p=13960>; DESCRIPTION: Cylindrical Battery Contacts, Clips, Holders & Springs THM Polarized Holder Dual 18650 Batteries; HEIGHT: 14.85mm; MANUFACTURER_NAME: Keystone Electronics; MANUFACTURER_PART_NUMBER: 1049P; MOUSER_PART_NUMBER: 534-1049P; MOUSER_PRICE-STOCK: https://www.mouser.co.uk/ProductDetail/Keystone-Electronics/1049P?qs=9%252Bwcgl%2FJqd1MGtj4f%252BuZyA%3D%3D
U$1-U$3 = rcl:0603_S
X1 X2 = TABOR K1:ML2: 2 pinovy konektor samec typu ML
Z1 Z2 = 52101-101-REV-A:SUPRESSOR_TVS-UD-: TVS UNI-DIRECTIONAL